# EAGLE schematic Logic_Probe (EAGLE 9.0.0)
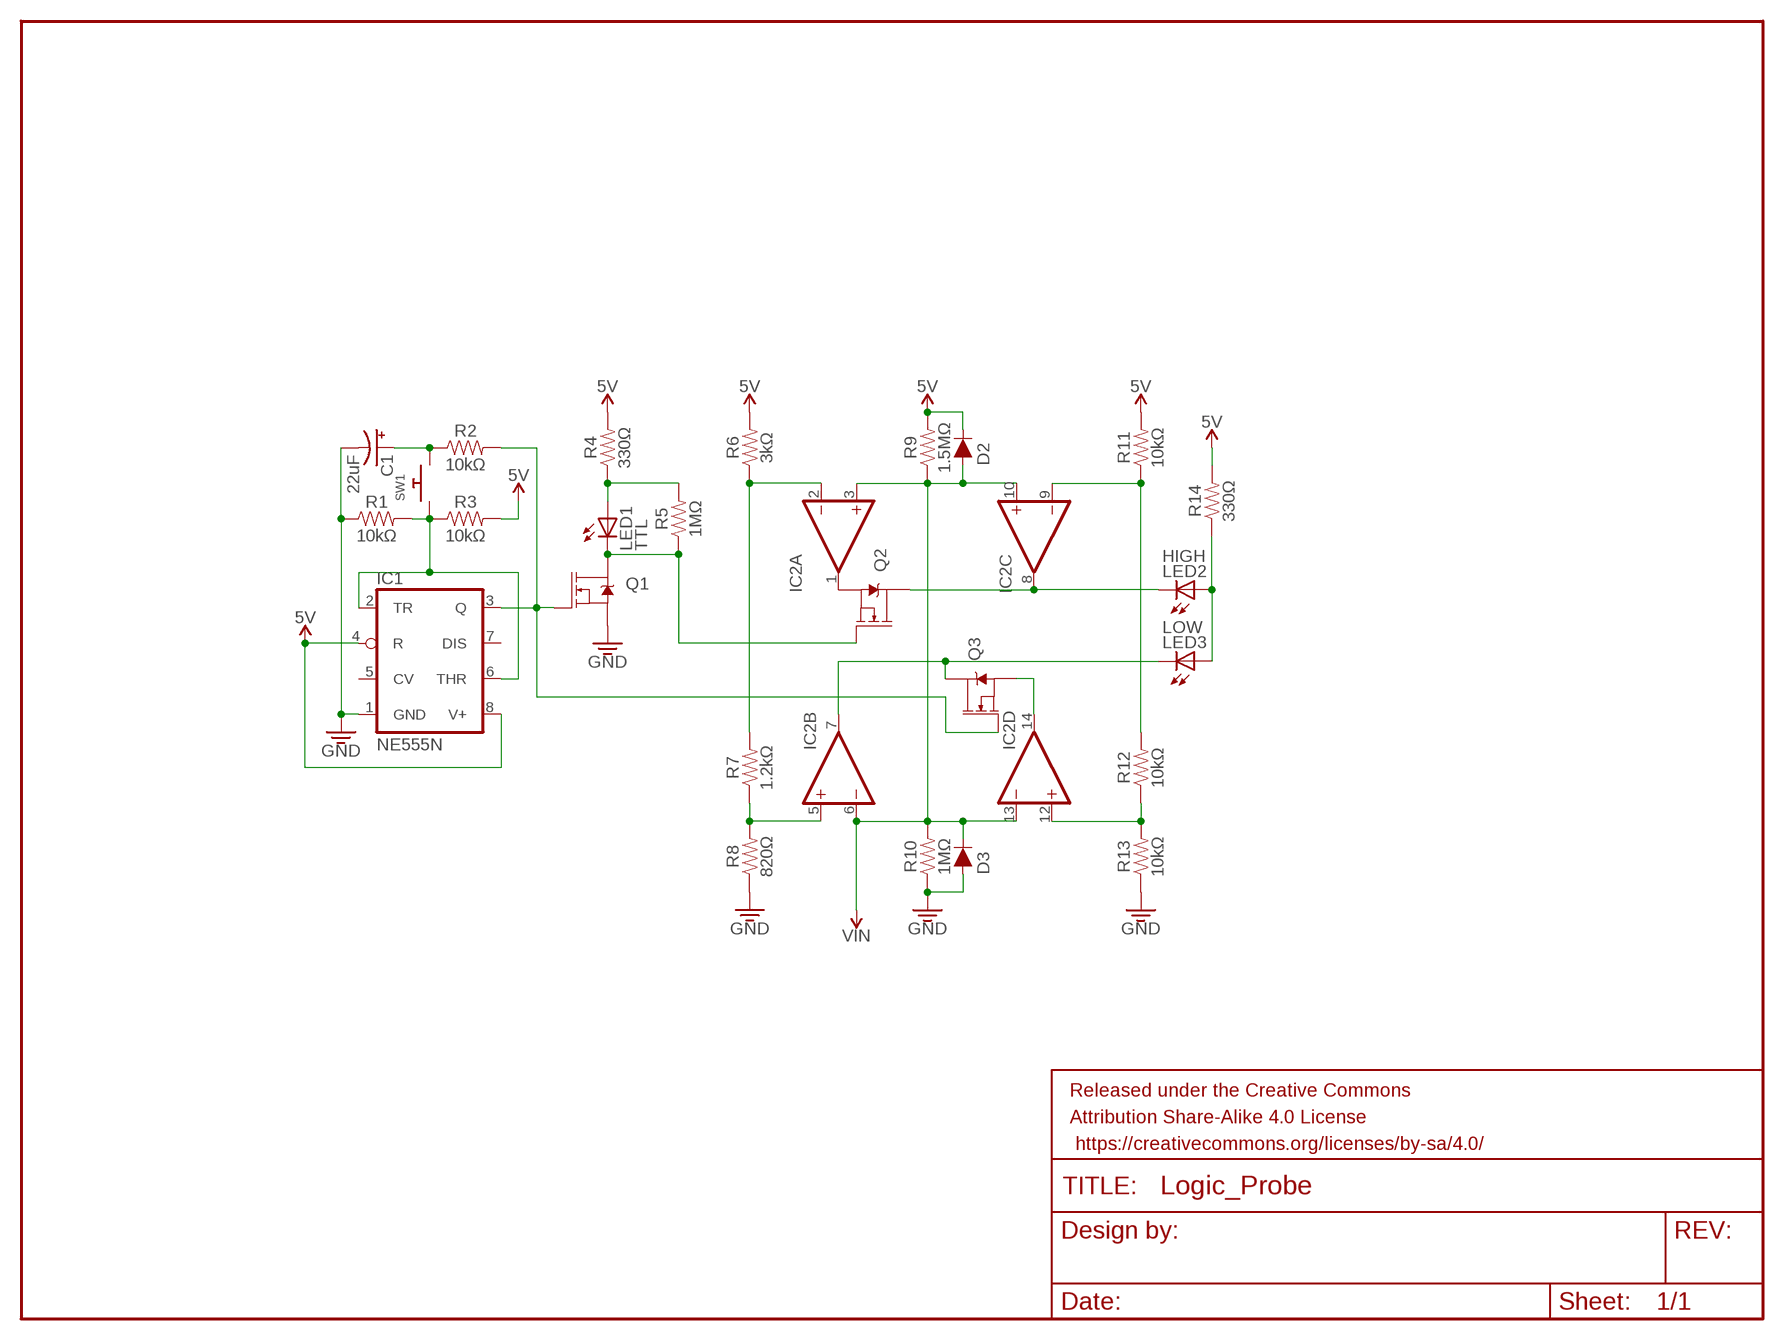
[diagram p0: schematic, sheet 1]

## Parts
C1  22uF  22UF-POLAR-PANASONIC_C-35V-20%  [PANASONIC_C]
D2  DIODE-1N4148  [DIODE-1N4148]
D3  DIODE-1N4148  [DIODE-1N4148]
FRAME1  FRAME-LETTER  [CREATIVE_COMMONS]
IC1  NE555N  [DIL08-ROUND]
IC2  QUAD_OPAMPP  [DIL14]
LED1  TTL  LED5MM  [LED5MM]
LED2  HIGH  LED5MM  [LED5MM]
LED3  LOW  LED5MM  [LED5MM]
Q1  MOSFET-NCH-2N7002PW  [SOT323]
Q2  MOSFET-NCH-2N7002PW  [SOT323]
Q3  MOSFET-NCH-2N7002PW  [SOT323]
R1  10kΩ  RESISTORAXIAL-0.3  [AXIAL-0.3]
R2  10kΩ  RESISTORAXIAL-0.3  [AXIAL-0.3]
R3  10kΩ  RESISTORAXIAL-0.3  [AXIAL-0.3]
R4  330Ω  RESISTORAXIAL-0.3  [AXIAL-0.3]
R5  1MΩ  RESISTORAXIAL-0.3  [AXIAL-0.3]
R6  3kΩ  RESISTORAXIAL-0.3  [AXIAL-0.3]
R7  1.2kΩ  RESISTORAXIAL-0.3  [AXIAL-0.3]
R8  820Ω  RESISTORAXIAL-0.3  [AXIAL-0.3]
R9  1.5MΩ  RESISTORAXIAL-0.3  [AXIAL-0.3]
R10  1MΩ  RESISTORAXIAL-0.3  [AXIAL-0.3]
R11  10kΩ  RESISTORAXIAL-0.3  [AXIAL-0.3]
R12  10kΩ  RESISTORAXIAL-0.3  [AXIAL-0.3]
R13  10kΩ  RESISTORAXIAL-0.3  [AXIAL-0.3]
R14  330Ω  RESISTORAXIAL-0.3  [AXIAL-0.3]
SW1  SWITCH_PUSHBUTTONEVQ-PE  [TACT_PANA-EVQ]

## Nets
3.3V: C1.- D3.A IC1.1(GND) Q1.2(S) R1.P$1 R8.P$1 R10.P$1 R13.P$1 ; supply symbol labelled GND
5V: D2.C IC1.4(R) IC1.8(V+) R3.P$2 R4.P$2 R6.P$2 R9.P$2 R11.P$2 R14.P$2
N$1: LED1.A R4.P$1 R5.P$2
N$2: LED1.K(C) Q1.3(D) Q2.1(G) R5.P$1
N$3: LED2.A LED3.A R14.P$1
N$4: IC1.2(TR) IC1.6(THR) R1.P$2 R3.P$1 SW1.P$1
N$5: C1.+ R2.P$1 SW1.P$2
N$6: IC2.5(B:+IN) R7.P$1 R8.P$2
N$7: IC1.3(Q) Q1.1(G) Q3.1(G) R2.P$2
N$8: IC2.2(A:-IN) R6.P$1 R7.P$2
N$9: IC2.12(D:+IN) R12.P$1 R13.P$2
N$10: IC2.9(C:-IN) R11.P$1 R12.P$2
N$11: IC2.7(B:OUT) LED3.K(C) Q3.3(D)
N$12: IC2.14(D:OUT) Q3.2(S)
N$13: IC2.1(A:OUT) Q2.2(S)
N$14: IC2.8(C:OUT) LED2.K(C) Q2.3(D)
VIN: D2.A D3.C IC2.3(A:+IN) IC2.6(B:-IN) IC2.10(C:+IN) IC2.13(D:-IN) R9.P$1 R10.P$2
Unconnected: IC1.5(CV) IC1.7(DIS)

## Power pins joined to a net without a drawn wire
V+: IC2.4(P:V+)
V-: IC2.11(P:V-)

## Library data of the parts
C1 = SparkFun-Capacitors:22UF-POLAR: 22µF polarized capacitors A capacitor is a passive two-terminal electrical component used to store electrical energy temporarily in an electric field.; PROD_ID: CAP-08618
D2 D3 = SparkFun-DiscreteSemi:DIODE: Diode These are standard reverse protection diodes and small signal diodes. SparkFun Products: SparkFun SparkPunk Sound Kit <https://www.sparkfun.com/products/11177> SparkFun ESP8266 Thing <https://www.sparkfun.com/products/13231>; PROD_ID: DIO-08378; VALUE: 200mA/100V/1V
FRAME1 = SparkFun-Aesthetics:FRAME-LETTER: Schematic Frame - Letter Standard 8.5x11 US Letter frame
IC1 = adafruit:*555: TIMER Changed DIP package to have round (not oval) pin pads http://www.ladyada.net/library/pcb/eaglelibrary.html
IC2 = adafruit:QUAD_OPAMP: OP AMP Standard quad package
LED1-LED3 = adafruit:LED: LED OSRAM: - CHIPLED LG R971, LG N971, LY N971, LG Q971, LY Q971, LO R971, LY R971 LH N974, LH R974 LS Q976, LO Q976, LY Q976 LO Q996 - Hyper CHIPLED LW Q18S LB Q993, LB Q99A, LB R99A - SideLED LS A670, LO A670, LY A670, LG A670, LP A670 LB A673, LV A673, LT A673, LW A673 LH A674 LY A675 LS A676, LA A676, LO A676, LY A676, LW A676 LS A679, LY A679, LG A679 - Hyper Micro SIDELED® LS Y876, LA Y876, LO Y876, LY Y876 LT Y87S - SmartLED LW L88C, LW L88S LB L89C, LB L89S, LG L890 LS L89K, LO L89K, LY L89K LS L896, LA L896, LO L896, LY L896 - TOPLED LS T670, LO T670, LY T670, LG T670, LP T670 LSG T670, LSP T670, LSY T670, LOP T670, LYG T670 LG T671, LOG T671, LSG T671 LB T673, LV T673, LT T673, LW T673 LH T674 LS T676, LA T676, LO T676, LY T676, LB T676, LH T676, LSB T676, LW T676 LB T67C, LV T67C, LT T67C, LS T67K, LO T67K, LY T67K, LW E67C LS E67B, LA E67B, LO E67B, LY E67B, LB E67C, LV E67C, LT E67C LW T67C LS T679, LY T679, LG T679 LS T770, LO T770, LY T770, LG T770, LP T770 LB T773, LV T773, LT T773, LW T773 LH T774 LS E675, LA E675, LY E675, LS T675 LS T776, LA T776, LO T776, LY T776, LB T776 LHGB T686 LT T68C, LB T68C - Hyper Mini TOPLED® LB M676 - Mini TOPLED Santana® LG M470 LS M47K, LO M47K, LY M47K Source: http://www.osram.convergy.de/
Q1-Q3 = SparkFun-DiscreteSemi:MOSFET-NCH: N-channel MOSFETs Voltage controlled devices that allow control of high current outputs. SparkFun Products: SparkFun OpenScale <https://www.sparkfun.com/products/13261> SparkFun Digital Sandbox <https://www.sparkfun.com/products/12651> SparkFun Monster Moto Shield <https://www.sparkfun.com/products/10182> SparkFun MOSFET Power Controller <https://www.sparkfun.com/products/11214>; PROD_ID: TRANS-11151; VALUE: 310mA/60V/1.6Ω
R1-R14 = SparkFun-Resistors:RESISTOR: Generic Resistor Package
SW1 = adafruit:SWITCH_PUSHBUTTON: Buttons SOFTTOUCHSMD_SJ - Soft touch temporary push button (Super Junk Akihabara) Compatible with SKPMANE010 [Mouser: 688-SKPMAN] C&K_KSS = Digikey: KSS221GLFS